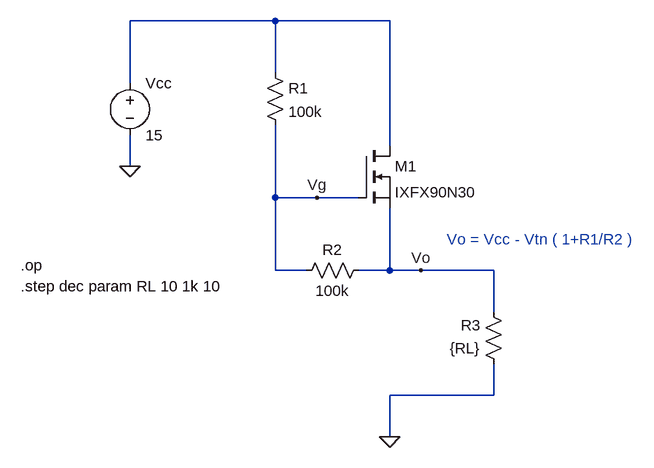
[diagram p0: schematic nMos_alone_regulator.asc]
nMos_alone_regulator.asc, the LTspice schematic file:
Version 4
SHEET 1 880 680
WIRE 192 0 -32 0
WIRE 368 0 192 0
WIRE 192 80 192 0
WIRE -32 96 -32 0
WIRE 368 192 368 0
WIRE -32 224 -32 176
WIRE 192 272 192 160
WIRE 256 272 192 272
WIRE 320 272 256 272
WIRE 192 384 192 272
WIRE 240 384 192 384
WIRE 368 384 368 288
WIRE 368 384 320 384
WIRE 416 384 368 384
WIRE 528 384 416 384
WIRE 528 448 528 384
WIRE 528 576 528 528
WIRE 528 576 368 576
WIRE 368 640 368 576
FLAG -32 224 0
FLAG 368 640 0
FLAG 416 384 Vo
FLAG 256 272 Vg
SYMBOL voltage -32 80 R0
WINDOW 123 0 0 Left 0
WINDOW 39 0 0 Left 0
SYMATTR InstName Vcc
SYMATTR Value 15
SYMBOL nmos 320 192 R0
SYMATTR InstName M1
SYMATTR Value IXFX90N30
SYMBOL res 176 64 R0
SYMATTR InstName R1
SYMATTR Value 100k
SYMBOL res 336 368 R90
WINDOW 0 0 56 VBottom 2
WINDOW 3 32 56 VTop 2
SYMATTR InstName R2
SYMATTR Value 100k
SYMBOL res 544 544 R180
WINDOW 0 36 76 Left 2
WINDOW 3 36 40 Left 2
SYMATTR InstName R3
SYMATTR Value {RL}
TEXT -200 376 Left 2 !.op
TEXT -200 408 Left 2 !.step dec param RL 10 1k 10
TEXT 456 336 Left 2 ;Vo = Vcc - Vtn ( 1+R1/R2 )

The netlist it stands for:
* nMos_alone_regulator.asc
Vcc N001 0 15
M1 N001 Vg Vo Vo IXFX90N30
R1 N001 Vg 100k
R2 Vo Vg 100k
R3 0 Vo {RL}
.model NMOS NMOS
.model PMOS PMOS
.lib standard.mos
.op
.step dec param RL 10 1k 10
* Vo = Vcc - Vtn ( 1+R1/R2 )
.backanno
.end